# EAGLE schematic tracker (EAGLE 9.6.2), part 1 of 2
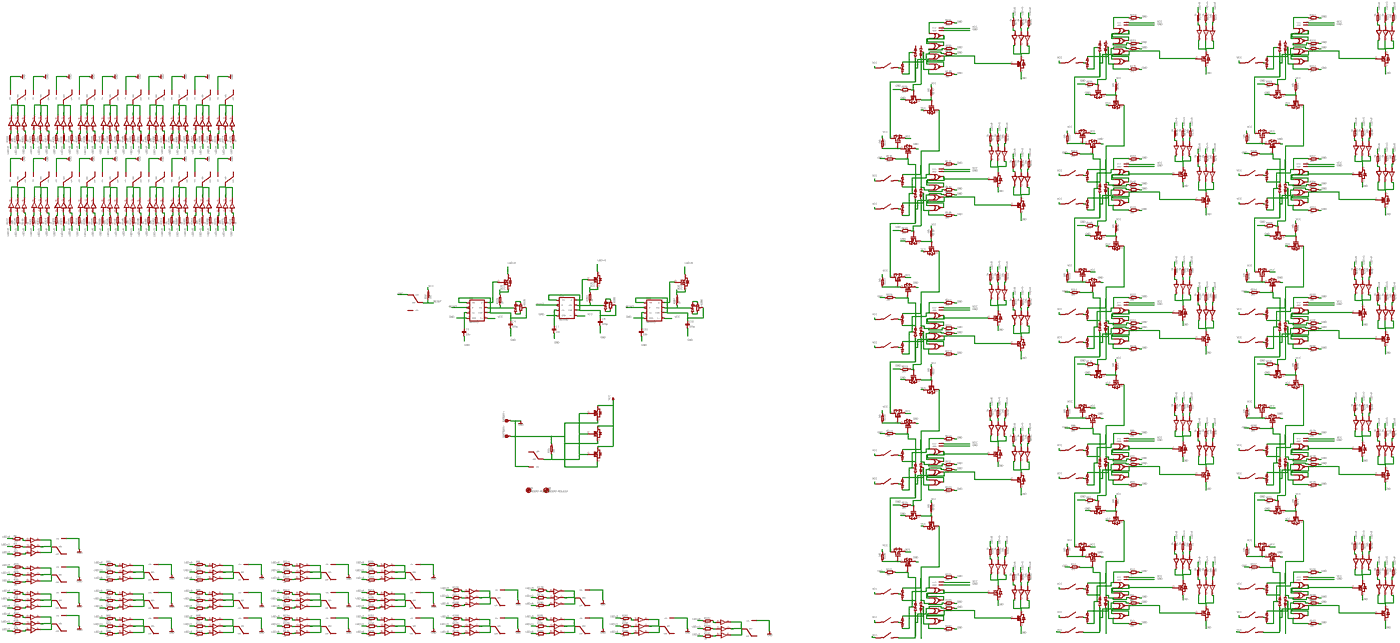
[diagram p0: schematic, sheet 1, overview]
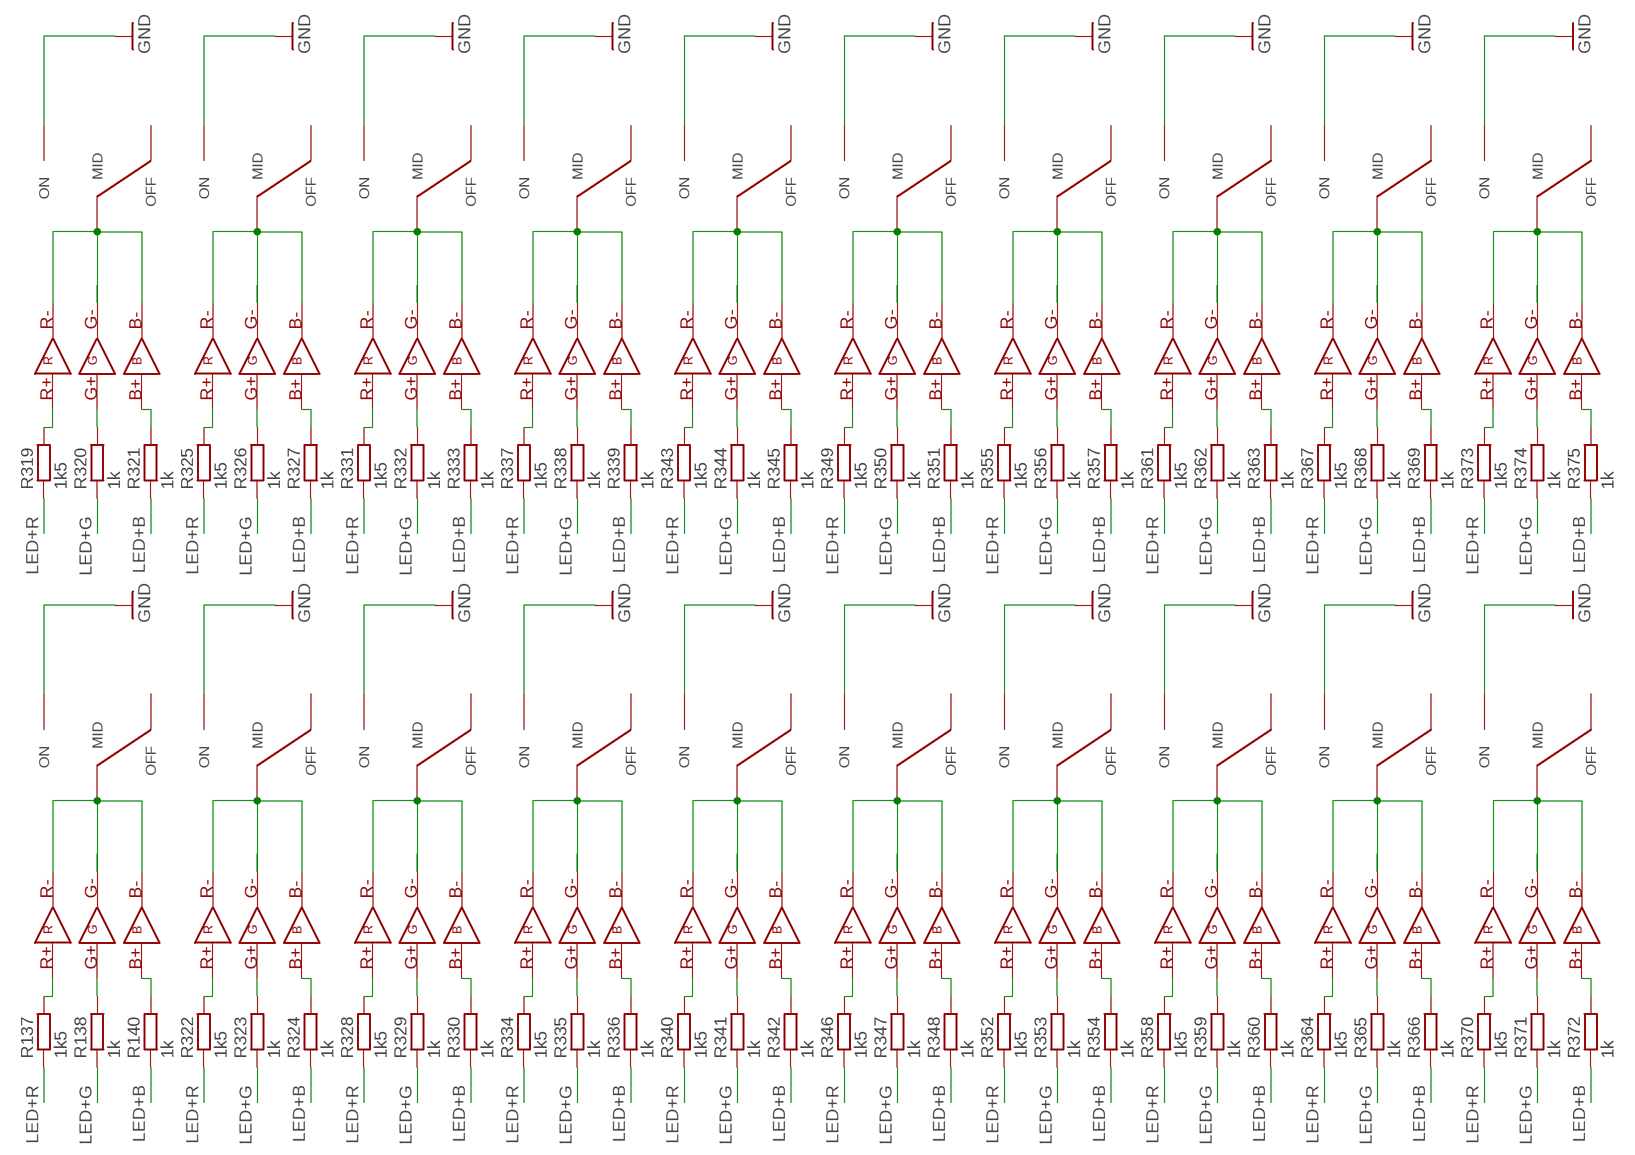
[diagram p1: schematic, sheet 1, part 1 of 5]
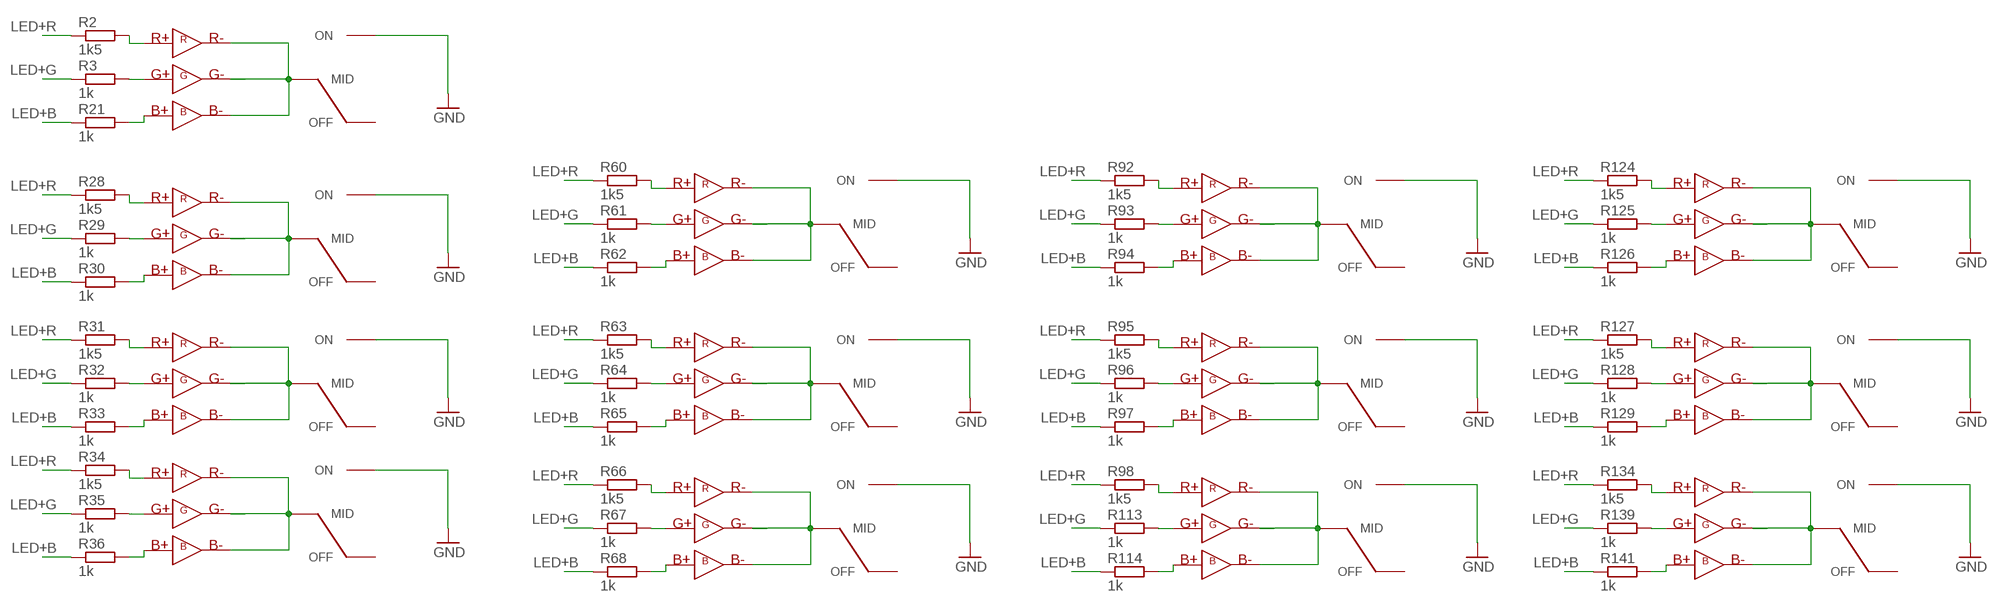
[diagram p2: schematic, sheet 1, part 2 of 5]
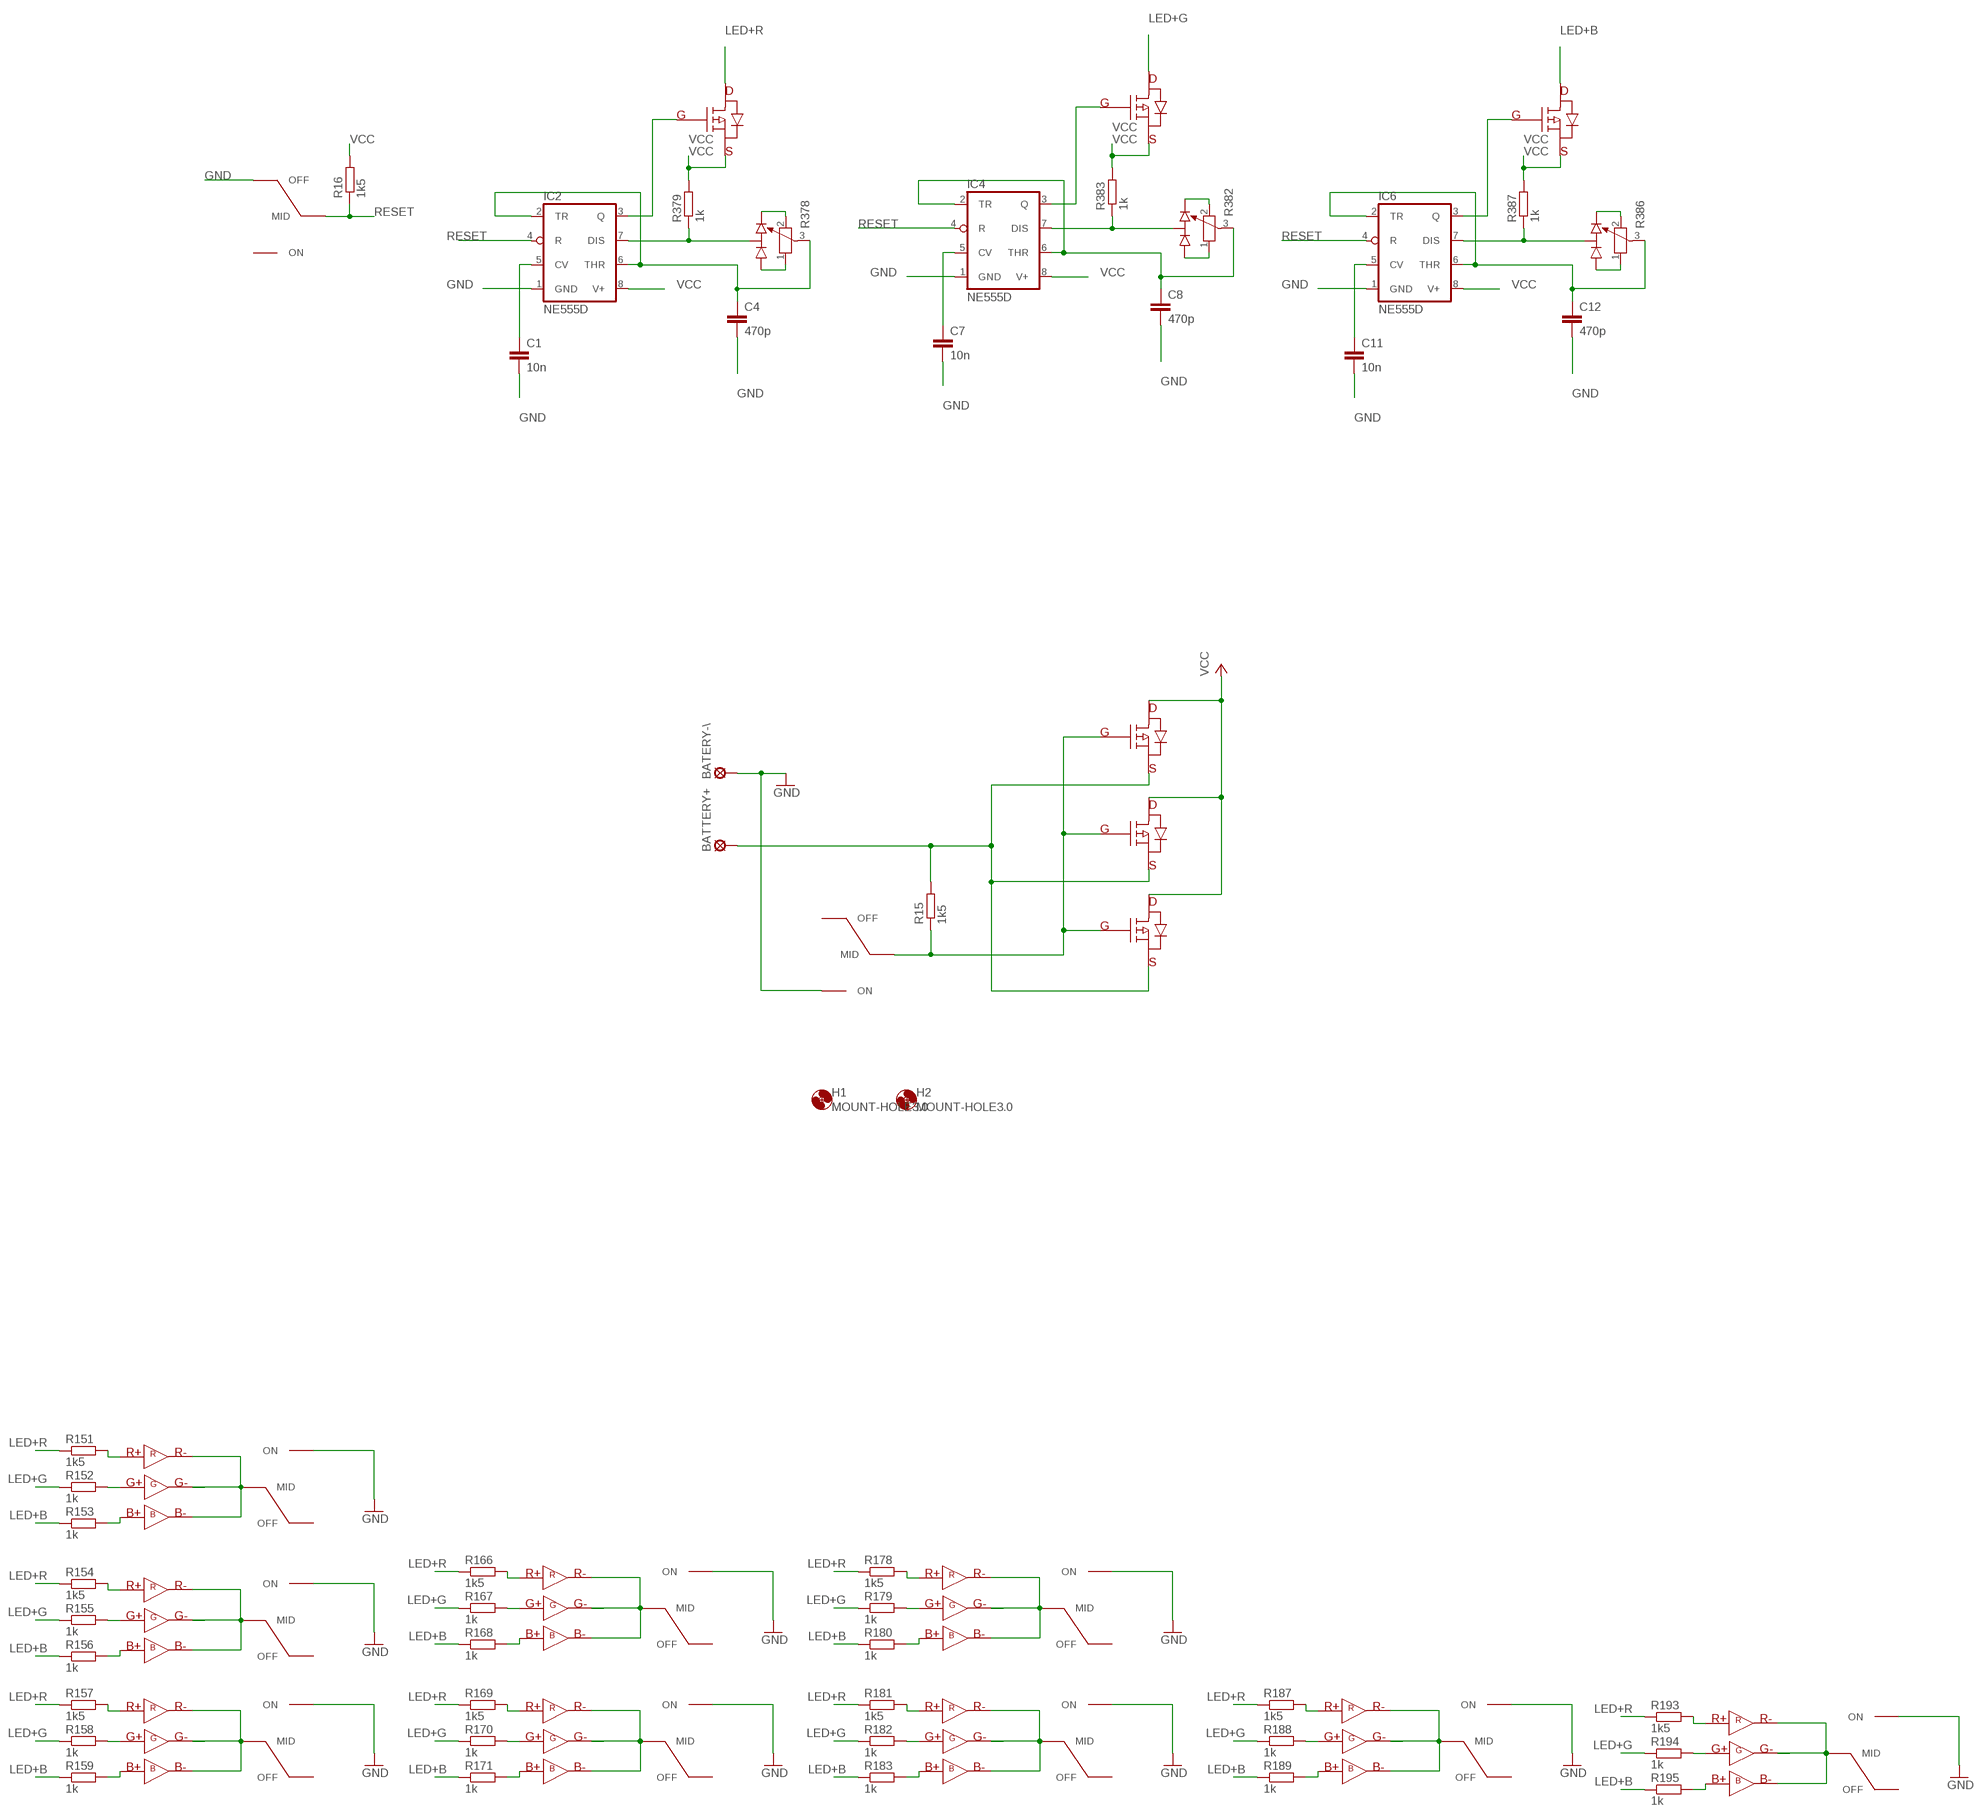
[diagram p3: schematic, sheet 1, part 3 of 5]
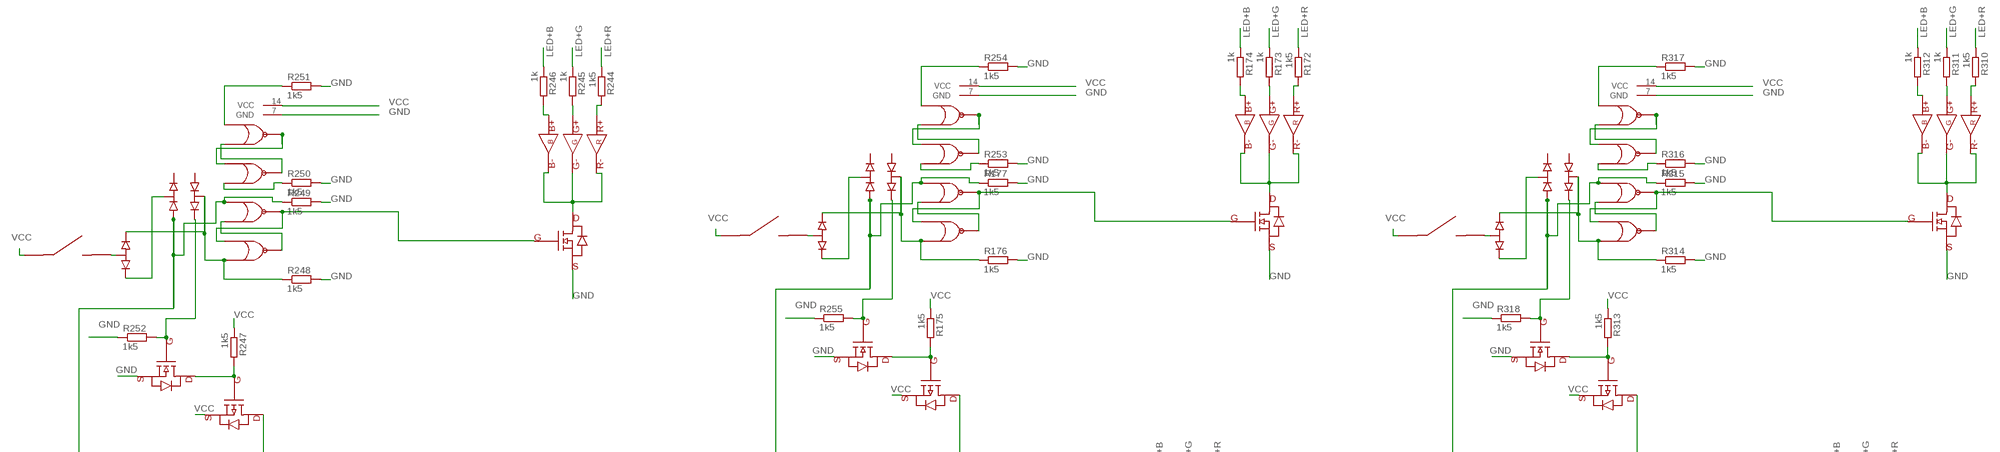
[diagram p4: schematic, sheet 1, part 4 of 5]
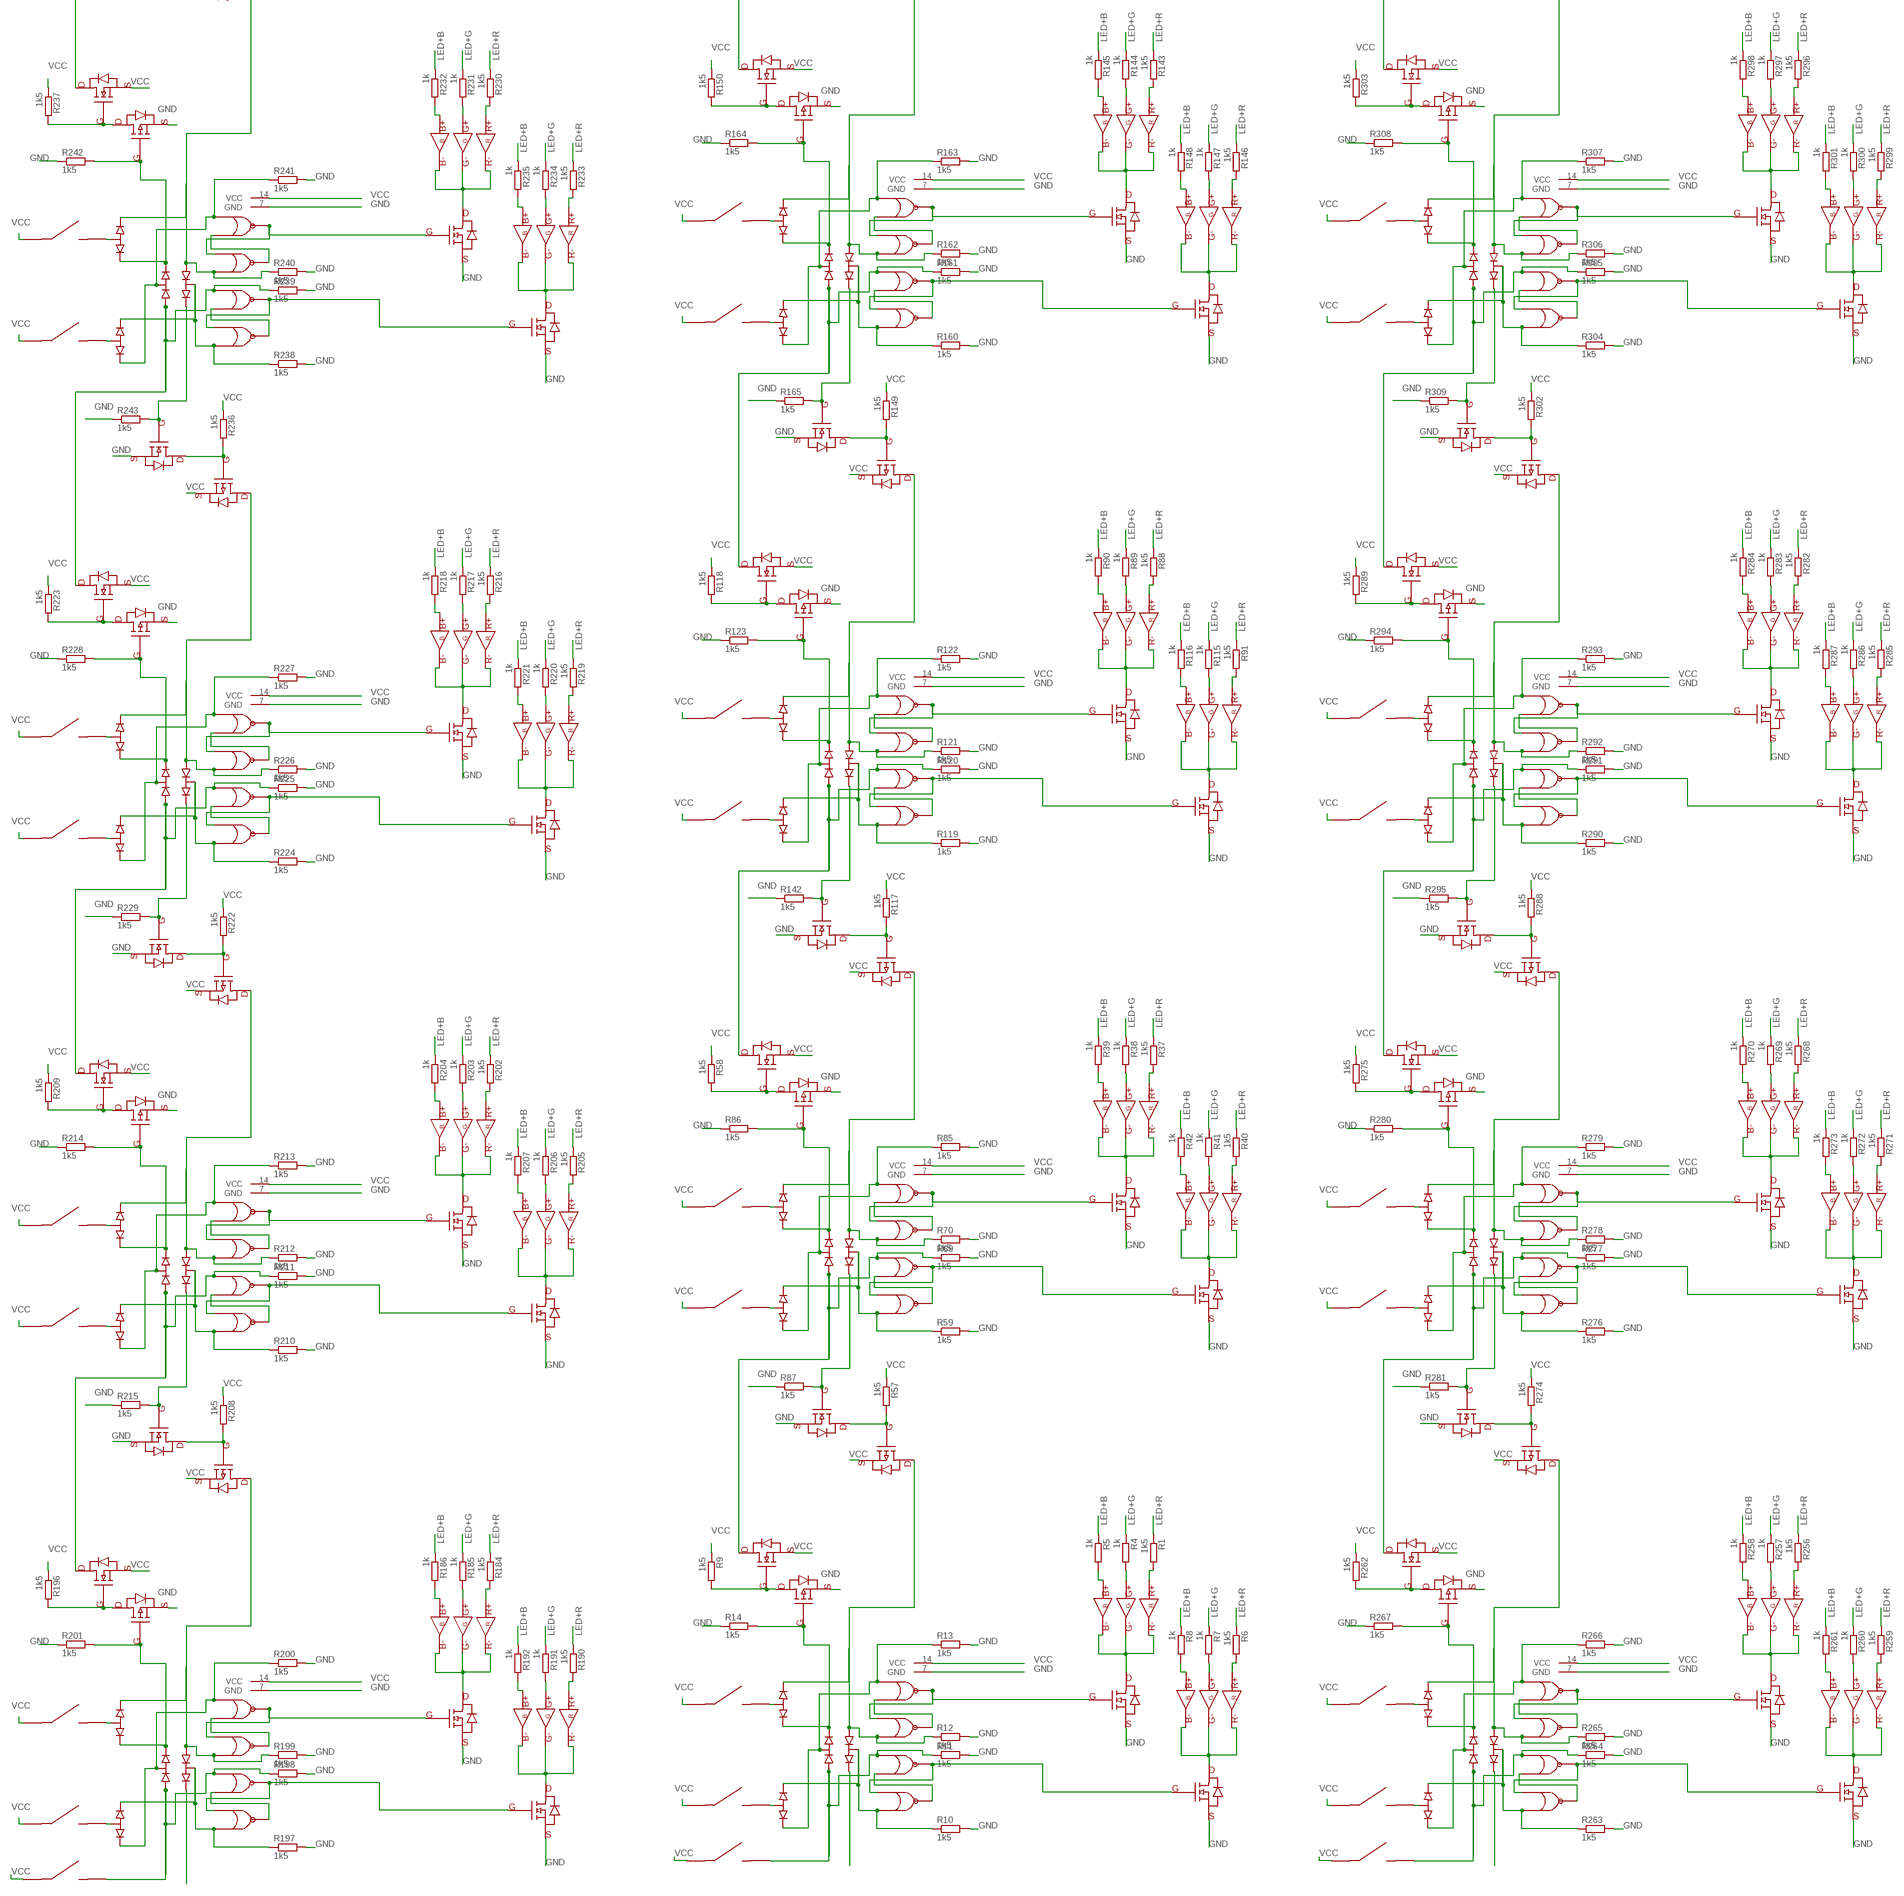
[diagram p5: schematic, sheet 1, part 5 of 5]

## Parts
BATERY-\  LSP10  [LSP10]
BATTERY+  LSP10  [LSP10]
C1  10n  C-EUC2012  [C2012]
C4  470p  C-EUC3216  [C3216]
C7  10n  C-EUC2012  [C2012]
C8  470p  C-EUC3216  [C3216]
C11  10n  C-EUC2012  [C2012]
C12  470p  C-EUC3216  [C3216]
H1  MOUNT-HOLE3.0  [3,0]
H2  MOUNT-HOLE3.0  [3,0]
IC2  NE555D  [SO08]
IC4  NE555D  [SO08]
IC6  NE555D  [SO08]
R1  1k5  R-EU_R0402  [R0402]
R2  1k5  R-EU_R0402  [R0402]
R3  1k  R-EU_R0402  [R0402]
R4  1k  R-EU_R0402  [R0402]
R5  1k  R-EU_R0402  [R0402]
R6  1k5  R-EU_R0402  [R0402]
R7  1k  R-EU_R0402  [R0402]
R8  1k  R-EU_R0402  [R0402]
R9  1k5  R-EU_R0402  [R0402]
R10  1k5  R-EU_R0402  [R0402]
R11  1k5  R-EU_R0402  [R0402]
R12  1k5  R-EU_R0402  [R0402]
R13  1k5  R-EU_R0402  [R0402]
R14  1k5  R-EU_R0402  [R0402]
R15  1k5  R-EU_R0402  [R0402]
R16  1k5  R-EU_R0402  [R0402]
R21  1k  R-EU_R0402  [R0402]
R28  1k5  R-EU_R0402  [R0402]
R29  1k  R-EU_R0402  [R0402]
R30  1k  R-EU_R0402  [R0402]
R31  1k5  R-EU_R0402  [R0402]
R32  1k  R-EU_R0402  [R0402]
R33  1k  R-EU_R0402  [R0402]
R34  1k5  R-EU_R0402  [R0402]
R35  1k  R-EU_R0402  [R0402]
R36  1k  R-EU_R0402  [R0402]
R37  1k5  R-EU_R0402  [R0402]
R38  1k  R-EU_R0402  [R0402]
R39  1k  R-EU_R0402  [R0402]
R40  1k5  R-EU_R0402  [R0402]
R41  1k  R-EU_R0402  [R0402]
R42  1k  R-EU_R0402  [R0402]
R57  1k5  R-EU_R0402  [R0402]
R58  1k5  R-EU_R0402  [R0402]
R59  1k5  R-EU_R0402  [R0402]
R60  1k5  R-EU_R0402  [R0402]
R61  1k  R-EU_R0402  [R0402]
R62  1k  R-EU_R0402  [R0402]
R63  1k5  R-EU_R0402  [R0402]
R64  1k  R-EU_R0402  [R0402]
R65  1k  R-EU_R0402  [R0402]
R66  1k5  R-EU_R0402  [R0402]
R67  1k  R-EU_R0402  [R0402]
R68  1k  R-EU_R0402  [R0402]
R69  1k5  R-EU_R0402  [R0402]
R70  1k5  R-EU_R0402  [R0402]
R85  1k5  R-EU_R0402  [R0402]
R86  1k5  R-EU_R0402  [R0402]
R87  1k5  R-EU_R0402  [R0402]
R88  1k5  R-EU_R0402  [R0402]
R89  1k  R-EU_R0402  [R0402]
R90  1k  R-EU_R0402  [R0402]
R91  1k5  R-EU_R0402  [R0402]
R92  1k5  R-EU_R0402  [R0402]
R93  1k  R-EU_R0402  [R0402]
R94  1k  R-EU_R0402  [R0402]
R95  1k5  R-EU_R0402  [R0402]
R96  1k  R-EU_R0402  [R0402]
R97  1k  R-EU_R0402  [R0402]
R98  1k5  R-EU_R0402  [R0402]
R113  1k  R-EU_R0402  [R0402]
R114  1k  R-EU_R0402  [R0402]
R115  1k  R-EU_R0402  [R0402]
R116  1k  R-EU_R0402  [R0402]
R117  1k5  R-EU_R0402  [R0402]
R118  1k5  R-EU_R0402  [R0402]
R119  1k5  R-EU_R0402  [R0402]
R120  1k5  R-EU_R0402  [R0402]
R121  1k5  R-EU_R0402  [R0402]
R122  1k5  R-EU_R0402  [R0402]
R123  1k5  R-EU_R0402  [R0402]
R124  1k5  R-EU_R0402  [R0402]
R125  1k  R-EU_R0402  [R0402]
R126  1k  R-EU_R0402  [R0402]
R127  1k5  R-EU_R0402  [R0402]
R128  1k  R-EU_R0402  [R0402]
R129  1k  R-EU_R0402  [R0402]
R134  1k5  R-EU_R0402  [R0402]
R137  1k5  R-EU_R0402  [R0402]
R138  1k  R-EU_R0402  [R0402]
R139  1k  R-EU_R0402  [R0402]
R140  1k  R-EU_R0402  [R0402]
R141  1k  R-EU_R0402  [R0402]
R142  1k5  R-EU_R0402  [R0402]
R143  1k5  R-EU_R0402  [R0402]
R144  1k  R-EU_R0402  [R0402]
R145  1k  R-EU_R0402  [R0402]
R146  1k5  R-EU_R0402  [R0402]
R147  1k  R-EU_R0402  [R0402]
R148  1k  R-EU_R0402  [R0402]
R149  1k5  R-EU_R0402  [R0402]
R150  1k5  R-EU_R0402  [R0402]
R151  1k5  R-EU_R0402  [R0402]
R152  1k  R-EU_R0402  [R0402]
R153  1k  R-EU_R0402  [R0402]
R154  1k5  R-EU_R0402  [R0402]
R155  1k  R-EU_R0402  [R0402]
R156  1k  R-EU_R0402  [R0402]
R157  1k5  R-EU_R0402  [R0402]
R158  1k  R-EU_R0402  [R0402]
R159  1k  R-EU_R0402  [R0402]
R160  1k5  R-EU_R0402  [R0402]
R161  1k5  R-EU_R0402  [R0402]
R162  1k5  R-EU_R0402  [R0402]
R163  1k5  R-EU_R0402  [R0402]
R164  1k5  R-EU_R0402  [R0402]
R165  1k5  R-EU_R0402  [R0402]
R166  1k5  R-EU_R0402  [R0402]
R167  1k  R-EU_R0402  [R0402]
R168  1k  R-EU_R0402  [R0402]
R169  1k5  R-EU_R0402  [R0402]
R170  1k  R-EU_R0402  [R0402]
R171  1k  R-EU_R0402  [R0402]
R172  1k5  R-EU_R0402  [R0402]
R173  1k  R-EU_R0402  [R0402]
R174  1k  R-EU_R0402  [R0402]
R175  1k5  R-EU_R0402  [R0402]
R176  1k5  R-EU_R0402  [R0402]
R177  1k5  R-EU_R0402  [R0402]
R178  1k5  R-EU_R0402  [R0402]
R179  1k  R-EU_R0402  [R0402]
R180  1k  R-EU_R0402  [R0402]
R181  1k5  R-EU_R0402  [R0402]
R182  1k  R-EU_R0402  [R0402]
R183  1k  R-EU_R0402  [R0402]
R184  1k5  R-EU_R0402  [R0402]
R185  1k  R-EU_R0402  [R0402]
R186  1k  R-EU_R0402  [R0402]
R187  1k5  R-EU_R0402  [R0402]
R188  1k  R-EU_R0402  [R0402]
R189  1k  R-EU_R0402  [R0402]
R190  1k5  R-EU_R0402  [R0402]
R191  1k  R-EU_R0402  [R0402]
R192  1k  R-EU_R0402  [R0402]
R193  1k5  R-EU_R0402  [R0402]
R194  1k  R-EU_R0402  [R0402]
R195  1k  R-EU_R0402  [R0402]
R196  1k5  R-EU_R0402  [R0402]
R197  1k5  R-EU_R0402  [R0402]
R198  1k5  R-EU_R0402  [R0402]
R199  1k5  R-EU_R0402  [R0402]
R200  1k5  R-EU_R0402  [R0402]
R201  1k5  R-EU_R0402  [R0402]
R202  1k5  R-EU_R0402  [R0402]
R203  1k  R-EU_R0402  [R0402]
R204  1k  R-EU_R0402  [R0402]
R205  1k5  R-EU_R0402  [R0402]
R206  1k  R-EU_R0402  [R0402]
R207  1k  R-EU_R0402  [R0402]
R208  1k5  R-EU_R0402  [R0402]
R209  1k5  R-EU_R0402  [R0402]
R210  1k5  R-EU_R0402  [R0402]
R211  1k5  R-EU_R0402  [R0402]
R212  1k5  R-EU_R0402  [R0402]
R213  1k5  R-EU_R0402  [R0402]
R214  1k5  R-EU_R0402  [R0402]
R215  1k5  R-EU_R0402  [R0402]
R216  1k5  R-EU_R0402  [R0402]
R217  1k  R-EU_R0402  [R0402]
R218  1k  R-EU_R0402  [R0402]
R219  1k5  R-EU_R0402  [R0402]
R220  1k  R-EU_R0402  [R0402]
R221  1k  R-EU_R0402  [R0402]
R222  1k5  R-EU_R0402  [R0402]
R223  1k5  R-EU_R0402  [R0402]
R224  1k5  R-EU_R0402  [R0402]
R225  1k5  R-EU_R0402  [R0402]
R226  1k5  R-EU_R0402  [R0402]
R227  1k5  R-EU_R0402  [R0402]
R228  1k5  R-EU_R0402  [R0402]
R229  1k5  R-EU_R0402  [R0402]
R230  1k5  R-EU_R0402  [R0402]
R231  1k  R-EU_R0402  [R0402]
R232  1k  R-EU_R0402  [R0402]
R233  1k5  R-EU_R0402  [R0402]
R234  1k  R-EU_R0402  [R0402]
R235  1k  R-EU_R0402  [R0402]
R236  1k5  R-EU_R0402  [R0402]
R237  1k5  R-EU_R0402  [R0402]
R238  1k5  R-EU_R0402  [R0402]
R239  1k5  R-EU_R0402  [R0402]
R240  1k5  R-EU_R0402  [R0402]
R241  1k5  R-EU_R0402  [R0402]
R242  1k5  R-EU_R0402  [R0402]
R243  1k5  R-EU_R0402  [R0402]
R244  1k5  R-EU_R0402  [R0402]
R245  1k  R-EU_R0402  [R0402]
R246  1k  R-EU_R0402  [R0402]
R247  1k5  R-EU_R0402  [R0402]
R248  1k5  R-EU_R0402  [R0402]
R249  1k5  R-EU_R0402  [R0402]
R250  1k5  R-EU_R0402  [R0402]
R251  1k5  R-EU_R0402  [R0402]
R252  1k5  R-EU_R0402  [R0402]
R253  1k5  R-EU_R0402  [R0402]
R254  1k5  R-EU_R0402  [R0402]
R255  1k5  R-EU_R0402  [R0402]
R256  1k5  R-EU_R0402  [R0402]
R257  1k  R-EU_R0402  [R0402]
R258  1k  R-EU_R0402  [R0402]
R259  1k5  R-EU_R0402  [R0402]
R260  1k  R-EU_R0402  [R0402]
R261  1k  R-EU_R0402  [R0402]
R262  1k5  R-EU_R0402  [R0402]
R263  1k5  R-EU_R0402  [R0402]
R264  1k5  R-EU_R0402  [R0402]
R265  1k5  R-EU_R0402  [R0402]
R266  1k5  R-EU_R0402  [R0402]
R267  1k5  R-EU_R0402  [R0402]
R268  1k5  R-EU_R0402  [R0402]
R269  1k  R-EU_R0402  [R0402]
R270  1k  R-EU_R0402  [R0402]
R271  1k5  R-EU_R0402  [R0402]
R272  1k  R-EU_R0402  [R0402]
R273  1k  R-EU_R0402  [R0402]
R274  1k5  R-EU_R0402  [R0402]
R275  1k5  R-EU_R0402  [R0402]
R276  1k5  R-EU_R0402  [R0402]
R277  1k5  R-EU_R0402  [R0402]
R278  1k5  R-EU_R0402  [R0402]
R279  1k5  R-EU_R0402  [R0402]
R280  1k5  R-EU_R0402  [R0402]
R281  1k5  R-EU_R0402  [R0402]
R282  1k5  R-EU_R0402  [R0402]
R283  1k  R-EU_R0402  [R0402]
R284  1k  R-EU_R0402  [R0402]
R285  1k5  R-EU_R0402  [R0402]
R286  1k  R-EU_R0402  [R0402]
R287  1k  R-EU_R0402  [R0402]
R288  1k5  R-EU_R0402  [R0402]
R289  1k5  R-EU_R0402  [R0402]
R290  1k5  R-EU_R0402  [R0402]
R291  1k5  R-EU_R0402  [R0402]
R292  1k5  R-EU_R0402  [R0402]
R293  1k5  R-EU_R0402  [R0402]
R294  1k5  R-EU_R0402  [R0402]
R295  1k5  R-EU_R0402  [R0402]
R296  1k5  R-EU_R0402  [R0402]
R297  1k  R-EU_R0402  [R0402]
R298  1k  R-EU_R0402  [R0402]
R299  1k5  R-EU_R0402  [R0402]
R300  1k  R-EU_R0402  [R0402]
R301  1k  R-EU_R0402  [R0402]
R302  1k5  R-EU_R0402  [R0402]
R303  1k5  R-EU_R0402  [R0402]
R304  1k5  R-EU_R0402  [R0402]
R305  1k5  R-EU_R0402  [R0402]
R306  1k5  R-EU_R0402  [R0402]
R307  1k5  R-EU_R0402  [R0402]
R308  1k5  R-EU_R0402  [R0402]
R309  1k5  R-EU_R0402  [R0402]
R310  1k5  R-EU_R0402  [R0402]
R311  1k  R-EU_R0402  [R0402]
R312  1k  R-EU_R0402  [R0402]
R313  1k5  R-EU_R0402  [R0402]
R314  1k5  R-EU_R0402  [R0402]
R315  1k5  R-EU_R0402  [R0402]
R316  1k5  R-EU_R0402  [R0402]
R317  1k5  R-EU_R0402  [R0402]
R318  1k5  R-EU_R0402  [R0402]
R319  1k5  R-EU_R0402  [R0402]
R320  1k  R-EU_R0402  [R0402]
R321  1k  R-EU_R0402  [R0402]
R322  1k5  R-EU_R0402  [R0402]
R323  1k  R-EU_R0402  [R0402]
R324  1k  R-EU_R0402  [R0402]
R325  1k5  R-EU_R0402  [R0402]
R326  1k  R-EU_R0402  [R0402]
R327  1k  R-EU_R0402  [R0402]
R328  1k5  R-EU_R0402  [R0402]
R329  1k  R-EU_R0402  [R0402]
R330  1k  R-EU_R0402  [R0402]
R331  1k5  R-EU_R0402  [R0402]
R332  1k  R-EU_R0402  [R0402]
R333  1k  R-EU_R0402  [R0402]
R334  1k5  R-EU_R0402  [R0402]
R335  1k  R-EU_R0402  [R0402]
R336  1k  R-EU_R0402  [R0402]
R337  1k5  R-EU_R0402  [R0402]
R338  1k  R-EU_R0402  [R0402]
R339  1k  R-EU_R0402  [R0402]
R340  1k5  R-EU_R0402  [R0402]
R341  1k  R-EU_R0402  [R0402]
R342  1k  R-EU_R0402  [R0402]
R343  1k5  R-EU_R0402  [R0402]
R344  1k  R-EU_R0402  [R0402]
R345  1k  R-EU_R0402  [R0402]
R346  1k5  R-EU_R0402  [R0402]
R347  1k  R-EU_R0402  [R0402]
R348  1k  R-EU_R0402  [R0402]
R349  1k5  R-EU_R0402  [R0402]
R350  1k  R-EU_R0402  [R0402]
R351  1k  R-EU_R0402  [R0402]
R352  1k5  R-EU_R0402  [R0402]
R353  1k  R-EU_R0402  [R0402]
R354  1k  R-EU_R0402  [R0402]
R355  1k5  R-EU_R0402  [R0402]
R356  1k  R-EU_R0402  [R0402]
R357  1k  R-EU_R0402  [R0402]
R358  1k5  R-EU_R0402  [R0402]
R359  1k  R-EU_R0402  [R0402]
R360  1k  R-EU_R0402  [R0402]
R361  1k5  R-EU_R0402  [R0402]
R362  1k  R-EU_R0402  [R0402]
R363  1k  R-EU_R0402  [R0402]
R364  1k5  R-EU_R0402  [R0402]
R365  1k  R-EU_R0402  [R0402]
R366  1k  R-EU_R0402  [R0402]
R367  1k5  R-EU_R0402  [R0402]
R368  1k  R-EU_R0402  [R0402]
R369  1k  R-EU_R0402  [R0402]
R370  1k5  R-EU_R0402  [R0402]
R371  1k  R-EU_R0402  [R0402]
R372  1k  R-EU_R0402  [R0402]
R373  1k5  R-EU_R0402  [R0402]
R374  1k  R-EU_R0402  [R0402]
R375  1k  R-EU_R0402  [R0402]
R378  POTENTIOMETER_PT-10  [PT-10]
R379  1k  R-EU_R0402  [R0402]
R382  POTENTIOMETER_PT-10  [PT-10]
R383  1k  R-EU_R0402  [R0402]
R386  POTENTIOMETER_PT-10  [PT-10]
R387  1k  R-EU_R0402  [R0402]
U$1  YJL2301D_PMOSFET  [SOT23]
U$2  YJL2301D_PMOSFET  [SOT23]
U$3  YJL2301D_PMOSFET  [SOT23]
U$4  74HC02PW_QUAD_NOR  [TSSOP14]
U$5  BAT54SW_SERIES_DIODES  [SOT323]
U$6  BAT54SW_SERIES_DIODES  [SOT323]
U$7  SMD_MOCROSWITCH  [SMD_MICROSWITCH]
U$8  SMD_MOCROSWITCH  [SMD_MICROSWITCH]
U$9  BAT5406W_COMON_CATHODE_DIODES  [SOT323]
U$10  BAT5406W_COMON_CATHODE_DIODES  [SOT323]
U$11  BISTABLESWITCH  [BISTABLE_SWITCH]
U$12  BISTABLESWITCH  [BISTABLE_SWITCH]
U$20  YJL2304A_NMOSFET  [SOT23@1]
U$22  BISTABLESWITCH  [BISTABLE_SWITCH]
U$24  TC5050RGB_LED  [BIG_SMD_LED]
U$25  BISTABLESWITCH  [BISTABLE_SWITCH]
U$26  TC5050RGB_LED  [BIG_SMD_LED]
U$27  BISTABLESWITCH  [BISTABLE_SWITCH]
U$28  TC5050RGB_LED  [BIG_SMD_LED]
U$29  BISTABLESWITCH  [BISTABLE_SWITCH]
U$30  TC5050RGB_LED  [BIG_SMD_LED]
U$31  YJL2304A_NMOSFET  [SOT23@1]
U$32  TC5050RGB_LED  [BIG_SMD_LED]
U$33  TC5050RGB_LED  [BIG_SMD_LED]
U$34  YJL2304A_NMOSFET  [SOT23@1]
U$35  YJL2301D_PMOSFET  [SOT23]
U$36  74HC02PW_QUAD_NOR  [TSSOP14]
U$37  BISTABLESWITCH  [BISTABLE_SWITCH]
U$38  TC5050RGB_LED  [BIG_SMD_LED]
U$39  BISTABLESWITCH  [BISTABLE_SWITCH]
U$40  TC5050RGB_LED  [BIG_SMD_LED]
U$43  BISTABLESWITCH  [BISTABLE_SWITCH]
U$44  TC5050RGB_LED  [BIG_SMD_LED]
U$57  BAT54SW_SERIES_DIODES  [SOT323]
U$59  BAT54SW_SERIES_DIODES  [SOT323]
U$60  SMD_MOCROSWITCH  [SMD_MICROSWITCH]
U$61  SMD_MOCROSWITCH  [SMD_MICROSWITCH]
U$62  BAT5406W_COMON_CATHODE_DIODES  [SOT323]
U$63  BAT5406W_COMON_CATHODE_DIODES  [SOT323]
U$64  BISTABLESWITCH  [BISTABLE_SWITCH]
U$65  TC5050RGB_LED  [BIG_SMD_LED]
U$66  BISTABLESWITCH  [BISTABLE_SWITCH]
U$67  TC5050RGB_LED  [BIG_SMD_LED]
U$68  BISTABLESWITCH  [BISTABLE_SWITCH]
U$69  TC5050RGB_LED  [BIG_SMD_LED]
U$70  YJL2304A_NMOSFET  [SOT23@1]
U$71  YJL2304A_NMOSFET  [SOT23@1]
U$72  TC5050RGB_LED  [BIG_SMD_LED]
U$73  TC5050RGB_LED  [BIG_SMD_LED]
U$74  YJL2304A_NMOSFET  [SOT23@1]
U$75  YJL2304A_NMOSFET  [SOT23@1]
U$87  BISTABLESWITCH  [BISTABLE_SWITCH]
U$88  TC5050RGB_LED  [BIG_SMD_LED]
U$89  BISTABLESWITCH  [BISTABLE_SWITCH]
U$90  TC5050RGB_LED  [BIG_SMD_LED]
U$91  BISTABLESWITCH  [BISTABLE_SWITCH]
U$92  TC5050RGB_LED  [BIG_SMD_LED]
U$93  BISTABLESWITCH  [BISTABLE_SWITCH]
U$94  TC5050RGB_LED  [BIG_SMD_LED]
U$95  BISTABLESWITCH  [BISTABLE_SWITCH]
U$96  TC5050RGB_LED  [BIG_SMD_LED]
U$97  YJL2301D_PMOSFET  [SOT23]
U$98  YJL2301D_PMOSFET  [SOT23]
U$99  74HC02PW_QUAD_NOR  [TSSOP14]
U$100  BAT54SW_SERIES_DIODES  [SOT323]
U$101  BAT54SW_SERIES_DIODES  [SOT323]
U$102  SMD_MOCROSWITCH  [SMD_MICROSWITCH]
U$103  BISTABLESWITCH  [BISTABLE_SWITCH]
U$104  TC5050RGB_LED  [BIG_SMD_LED]
U$105  BISTABLESWITCH  [BISTABLE_SWITCH]
U$106  BISTABLESWITCH  [BISTABLE_SWITCH]
U$107  TC5050RGB_LED  [BIG_SMD_LED]
U$108  BISTABLESWITCH  [BISTABLE_SWITCH]
U$109  TC5050RGB_LED  [BIG_SMD_LED]
U$110  BISTABLESWITCH  [BISTABLE_SWITCH]
U$111  TC5050RGB_LED  [BIG_SMD_LED]
U$112  BISTABLESWITCH  [BISTABLE_SWITCH]
U$113  TC5050RGB_LED  [BIG_SMD_LED]
U$114  BISTABLESWITCH  [BISTABLE_SWITCH]
U$115  TC5050RGB_LED  [BIG_SMD_LED]
U$116  BISTABLESWITCH  [BISTABLE_SWITCH]
U$117  TC5050RGB_LED  [BIG_SMD_LED]
U$118  BISTABLESWITCH  [BISTABLE_SWITCH]
U$119  TC5050RGB_LED  [BIG_SMD_LED]
U$120  BISTABLESWITCH  [BISTABLE_SWITCH]
U$121  TC5050RGB_LED  [BIG_SMD_LED]
U$122  BISTABLESWITCH  [BISTABLE_SWITCH]
U$123  TC5050RGB_LED  [BIG_SMD_LED]
U$124  SMD_MOCROSWITCH  [SMD_MICROSWITCH]
U$125  BAT5406W_COMON_CATHODE_DIODES  [SOT323]
U$126  BAT5406W_COMON_CATHODE_DIODES  [SOT323]
U$127  YJL2304A_NMOSFET  [SOT23@1]
U$128  BISTABLESWITCH  [BISTABLE_SWITCH]
U$129  TC5050RGB_LED  [BIG_SMD_LED]
U$130  BISTABLESWITCH  [BISTABLE_SWITCH]
U$131  TC5050RGB_LED  [BIG_SMD_LED]
U$132  YJL2304A_NMOSFET  [SOT23@1]
U$133  TC5050RGB_LED  [BIG_SMD_LED]
U$134  TC5050RGB_LED  [BIG_SMD_LED]
U$135  YJL2304A_NMOSFET  [SOT23@1]
U$136  TC5050RGB_LED  [BIG_SMD_LED]
U$137  BISTABLESWITCH  [BISTABLE_SWITCH]
U$138  TC5050RGB_LED  [BIG_SMD_LED]
U$139  BISTABLESWITCH  [BISTABLE_SWITCH]
U$140  BISTABLESWITCH  [BISTABLE_SWITCH]
U$141  TC5050RGB_LED  [BIG_SMD_LED]
U$142  TC5050RGB_LED  [BIG_SMD_LED]
U$143  BISTABLESWITCH  [BISTABLE_SWITCH]
U$144  BISTABLESWITCH  [BISTABLE_SWITCH]
U$145  TC5050RGB_LED  [BIG_SMD_LED]
U$146  TC5050RGB_LED  [BIG_SMD_LED]
U$147  BISTABLESWITCH  [BISTABLE_SWITCH]
U$148  74HC02PW_QUAD_NOR  [TSSOP14]
U$149  TC5050RGB_LED  [BIG_SMD_LED]
U$150  BAT54SW_SERIES_DIODES  [SOT323]
U$151  BISTABLESWITCH  [BISTABLE_SWITCH]
U$152  TC5050RGB_LED  [BIG_SMD_LED]
U$153  BAT54SW_SERIES_DIODES  [SOT323]
U$154  SMD_MOCROSWITCH  [SMD_MICROSWITCH]
U$155  BISTABLESWITCH  [BISTABLE_SWITCH]
U$156  TC5050RGB_LED  [BIG_SMD_LED]
U$157  SMD_MOCROSWITCH  [SMD_MICROSWITCH]
U$158  BAT5406W_COMON_CATHODE_DIODES  [SOT323]
U$159  BAT5406W_COMON_CATHODE_DIODES  [SOT323]
U$160  YJL2304A_NMOSFET  [SOT23@1]
U$161  YJL2304A_NMOSFET  [SOT23@1]
U$162  TC5050RGB_LED  [BIG_SMD_LED]
U$163  TC5050RGB_LED  [BIG_SMD_LED]
U$164  YJL2304A_NMOSFET  [SOT23@1]
U$165  YJL2301D_PMOSFET  [SOT23]
U$166  74HC02PW_QUAD_NOR  [TSSOP14]
U$167  BAT54SW_SERIES_DIODES  [SOT323]
U$168  BAT54SW_SERIES_DIODES  [SOT323]
U$169  SMD_MOCROSWITCH  [SMD_MICROSWITCH]
U$170  SMD_MOCROSWITCH  [SMD_MICROSWITCH]
U$171  BAT5406W_COMON_CATHODE_DIODES  [SOT323]
U$172  BAT5406W_COMON_CATHODE_DIODES  [SOT323]
U$173  YJL2304A_NMOSFET  [SOT23@1]
U$174  YJL2304A_NMOSFET  [SOT23@1]
U$175  TC5050RGB_LED  [BIG_SMD_LED]
U$176  TC5050RGB_LED  [BIG_SMD_LED]
U$177  YJL2304A_NMOSFET  [SOT23@1]
U$178  YJL2304A_NMOSFET  [SOT23@1]
U$179  YJL2301D_PMOSFET  [SOT23]
U$180  YJL2301D_PMOSFET  [SOT23]
U$181  74HC02PW_QUAD_NOR  [TSSOP14]
U$182  BAT54SW_SERIES_DIODES  [SOT323]
U$183  BAT54SW_SERIES_DIODES  [SOT323]
U$184  SMD_MOCROSWITCH  [SMD_MICROSWITCH]
U$185  SMD_MOCROSWITCH  [SMD_MICROSWITCH]
U$186  BAT5406W_COMON_CATHODE_DIODES  [SOT323]
U$187  BAT5406W_COMON_CATHODE_DIODES  [SOT323]
U$188  YJL2304A_NMOSFET  [SOT23@1]
U$189  YJL2304A_NMOSFET  [SOT23@1]
U$190  TC5050RGB_LED  [BIG_SMD_LED]
U$191  TC5050RGB_LED  [BIG_SMD_LED]
U$192  YJL2304A_NMOSFET  [SOT23@1]
U$193  YJL2304A_NMOSFET  [SOT23@1]
U$194  YJL2301D_PMOSFET  [SOT23]
U$195  YJL2301D_PMOSFET  [SOT23]
U$196  74HC02PW_QUAD_NOR  [TSSOP14]
U$197  BAT54SW_SERIES_DIODES  [SOT323]
U$198  BAT54SW_SERIES_DIODES  [SOT323]
U$199  SMD_MOCROSWITCH  [SMD_MICROSWITCH]
U$200  SMD_MOCROSWITCH  [SMD_MICROSWITCH]
U$201  BAT5406W_COMON_CATHODE_DIODES  [SOT323]
U$202  BAT5406W_COMON_CATHODE_DIODES  [SOT323]
U$203  YJL2304A_NMOSFET  [SOT23@1]
U$204  YJL2304A_NMOSFET  [SOT23@1]
U$205  TC5050RGB_LED  [BIG_SMD_LED]
U$206  TC5050RGB_LED  [BIG_SMD_LED]
U$207  YJL2304A_NMOSFET  [SOT23@1]
U$208  YJL2304A_NMOSFET  [SOT23@1]
U$209  YJL2301D_PMOSFET  [SOT23]
U$210  YJL2301D_PMOSFET  [SOT23]
U$211  74HC02PW_QUAD_NOR  [TSSOP14]
U$212  BAT54SW_SERIES_DIODES  [SOT323]
U$213  BAT54SW_SERIES_DIODES  [SOT323]
U$214  SMD_MOCROSWITCH  [SMD_MICROSWITCH]
U$215  BAT5406W_COMON_CATHODE_DIODES  [SOT323]
U$216  YJL2304A_NMOSFET  [SOT23@1]
U$217  TC5050RGB_LED  [BIG_SMD_LED]
U$218  YJL2304A_NMOSFET  [SOT23@1]
U$219  YJL2301D_PMOSFET  [SOT23]
U$220  SMD_MOCROSWITCH  [SMD_MICROSWITCH]
U$221  YJL2304A_NMOSFET  [SOT23@1]
U$222  YJL2301D_PMOSFET  [SOT23]
U$223  YJL2301D_PMOSFET  [SOT23]
U$224  74HC02PW_QUAD_NOR  [TSSOP14]
U$225  BAT54SW_SERIES_DIODES  [SOT323]
U$226  BAT54SW_SERIES_DIODES  [SOT323]
U$227  SMD_MOCROSWITCH  [SMD_MICROSWITCH]
U$228  SMD_MOCROSWITCH  [SMD_MICROSWITCH]
U$229  BAT5406W_COMON_CATHODE_DIODES  [SOT323]
U$230  BAT5406W_COMON_CATHODE_DIODES  [SOT323]
U$231  YJL2304A_NMOSFET  [SOT23@1]
U$232  YJL2304A_NMOSFET  [SOT23@1]
U$233  TC5050RGB_LED  [BIG_SMD_LED]
U$234  TC5050RGB_LED  [BIG_SMD_LED]
U$235  YJL2304A_NMOSFET  [SOT23@1]
U$236  YJL2304A_NMOSFET  [SOT23@1]
U$237  YJL2301D_PMOSFET  [SOT23]
U$238  YJL2301D_PMOSFET  [SOT23]
U$239  74HC02PW_QUAD_NOR  [TSSOP14]
U$240  BAT54SW_SERIES_DIODES  [SOT323]
U$241  BAT54SW_SERIES_DIODES  [SOT323]
U$242  SMD_MOCROSWITCH  [SMD_MICROSWITCH]
U$243  BAT5406W_COMON_CATHODE_DIODES  [SOT323]
U$244  YJL2304A_NMOSFET  [SOT23@1]
U$245  TC5050RGB_LED  [BIG_SMD_LED]
U$246  YJL2304A_NMOSFET  [SOT23@1]
U$247  YJL2301D_PMOSFET  [SOT23]
U$248  SMD_MOCROSWITCH  [SMD_MICROSWITCH]
U$249  74HC02PW_QUAD_NOR  [TSSOP14]
U$250  BAT54SW_SERIES_DIODES  [SOT323]
U$251  BAT54SW_SERIES_DIODES  [SOT323]
U$252  SMD_MOCROSWITCH  [SMD_MICROSWITCH]
U$253  SMD_MOCROSWITCH  [SMD_MICROSWITCH]
U$254  BAT5406W_COMON_CATHODE_DIODES  [SOT323]
U$255  BAT5406W_COMON_CATHODE_DIODES  [SOT323]
U$256  YJL2304A_NMOSFET  [SOT23@1]
U$257  YJL2304A_NMOSFET  [SOT23@1]
U$258  TC5050RGB_LED  [BIG_SMD_LED]
U$259  TC5050RGB_LED  [BIG_SMD_LED]
U$260  YJL2304A_NMOSFET  [SOT23@1]
U$261  YJL2301D_PMOSFET  [SOT23]
U$262  74HC02PW_QUAD_NOR  [TSSOP14]
U$263  BAT54SW_SERIES_DIODES  [SOT323]
U$264  BAT54SW_SERIES_DIODES  [SOT323]
U$265  SMD_MOCROSWITCH  [SMD_MICROSWITCH]
U$266  SMD_MOCROSWITCH  [SMD_MICROSWITCH]
U$267  BAT5406W_COMON_CATHODE_DIODES  [SOT323]
U$268  BAT5406W_COMON_CATHODE_DIODES  [SOT323]
U$269  YJL2304A_NMOSFET  [SOT23@1]
U$270  YJL2304A_NMOSFET  [SOT23@1]
U$271  TC5050RGB_LED  [BIG_SMD_LED]
U$272  TC5050RGB_LED  [BIG_SMD_LED]
U$273  YJL2304A_NMOSFET  [SOT23@1]
U$274  YJL2304A_NMOSFET  [SOT23@1]
U$275  YJL2301D_PMOSFET  [SOT23]
U$276  YJL2301D_PMOSFET  [SOT23]
U$277  74HC02PW_QUAD_NOR  [TSSOP14]
U$278  BAT54SW_SERIES_DIODES  [SOT323]
U$279  BAT54SW_SERIES_DIODES  [SOT323]
U$280  SMD_MOCROSWITCH  [SMD_MICROSWITCH]
U$281  SMD_MOCROSWITCH  [SMD_MICROSWITCH]
U$282  BAT5406W_COMON_CATHODE_DIODES  [SOT323]
U$283  BAT5406W_COMON_CATHODE_DIODES  [SOT323]
U$284  YJL2304A_NMOSFET  [SOT23@1]
U$285  YJL2304A_NMOSFET  [SOT23@1]
U$286  TC5050RGB_LED  [BIG_SMD_LED]
U$287  TC5050RGB_LED  [BIG_SMD_LED]
U$288  YJL2304A_NMOSFET  [SOT23@1]
U$289  YJL2304A_NMOSFET  [SOT23@1]
U$290  YJL2301D_PMOSFET  [SOT23]
U$291  YJL2301D_PMOSFET  [SOT23]
U$292  74HC02PW_QUAD_NOR  [TSSOP14]
U$293  BAT54SW_SERIES_DIODES  [SOT323]
U$294  BAT54SW_SERIES_DIODES  [SOT323]
U$295  SMD_MOCROSWITCH  [SMD_MICROSWITCH]
U$296  SMD_MOCROSWITCH  [SMD_MICROSWITCH]
U$297  BAT5406W_COMON_CATHODE_DIODES  [SOT323]
U$298  BAT5406W_COMON_CATHODE_DIODES  [SOT323]
U$299  YJL2304A_NMOSFET  [SOT23@1]
U$300  YJL2304A_NMOSFET  [SOT23@1]
U$301  TC5050RGB_LED  [BIG_SMD_LED]
U$302  TC5050RGB_LED  [BIG_SMD_LED]
U$303  YJL2304A_NMOSFET  [SOT23@1]
U$304  YJL2304A_NMOSFET  [SOT23@1]
U$305  YJL2301D_PMOSFET  [SOT23]
U$306  YJL2301D_PMOSFET  [SOT23]
U$307  74HC02PW_QUAD_NOR  [TSSOP14]
U$308  BAT54SW_SERIES_DIODES  [SOT323]
U$309  BAT54SW_SERIES_DIODES  [SOT323]
U$310  SMD_MOCROSWITCH  [SMD_MICROSWITCH]
U$311  BAT5406W_COMON_CATHODE_DIODES  [SOT323]
U$312  YJL2304A_NMOSFET  [SOT23@1]
U$313  TC5050RGB_LED  [BIG_SMD_LED]
U$314  YJL2304A_NMOSFET  [SOT23@1]
U$315  YJL2301D_PMOSFET  [SOT23]
U$316  SMD_MOCROSWITCH  [SMD_MICROSWITCH]
U$317  BISTABLESWITCH  [BISTABLE_SWITCH]
U$318  TC5050RGB_LED  [BIG_SMD_LED]
U$319  BISTABLESWITCH  [BISTABLE_SWITCH]
U$320  TC5050RGB_LED  [BIG_SMD_LED]
U$321  BISTABLESWITCH  [BISTABLE_SWITCH]
U$322  TC5050RGB_LED  [BIG_SMD_LED]
U$323  BISTABLESWITCH  [BISTABLE_SWITCH]
U$324  TC5050RGB_LED  [BIG_SMD_LED]
U$325  BISTABLESWITCH  [BISTABLE_SWITCH]
U$326  TC5050RGB_LED  [BIG_SMD_LED]
U$327  BISTABLESWITCH  [BISTABLE_SWITCH]
U$328  TC5050RGB_LED  [BIG_SMD_LED]
U$331  YJL2301D_PMOSFET  [SOT23]
U$332  BAT54SW_SERIES_DIODES  [SOT323]
U$335  YJL2301D_PMOSFET  [SOT23]
U$336  BAT54SW_SERIES_DIODES  [SOT323]
U$339  YJL2301D_PMOSFET  [SOT23]
U$340  BAT54SW_SERIES_DIODES  [SOT323]